# Altium schematic sheet GSMM66.SchDoc
size A2
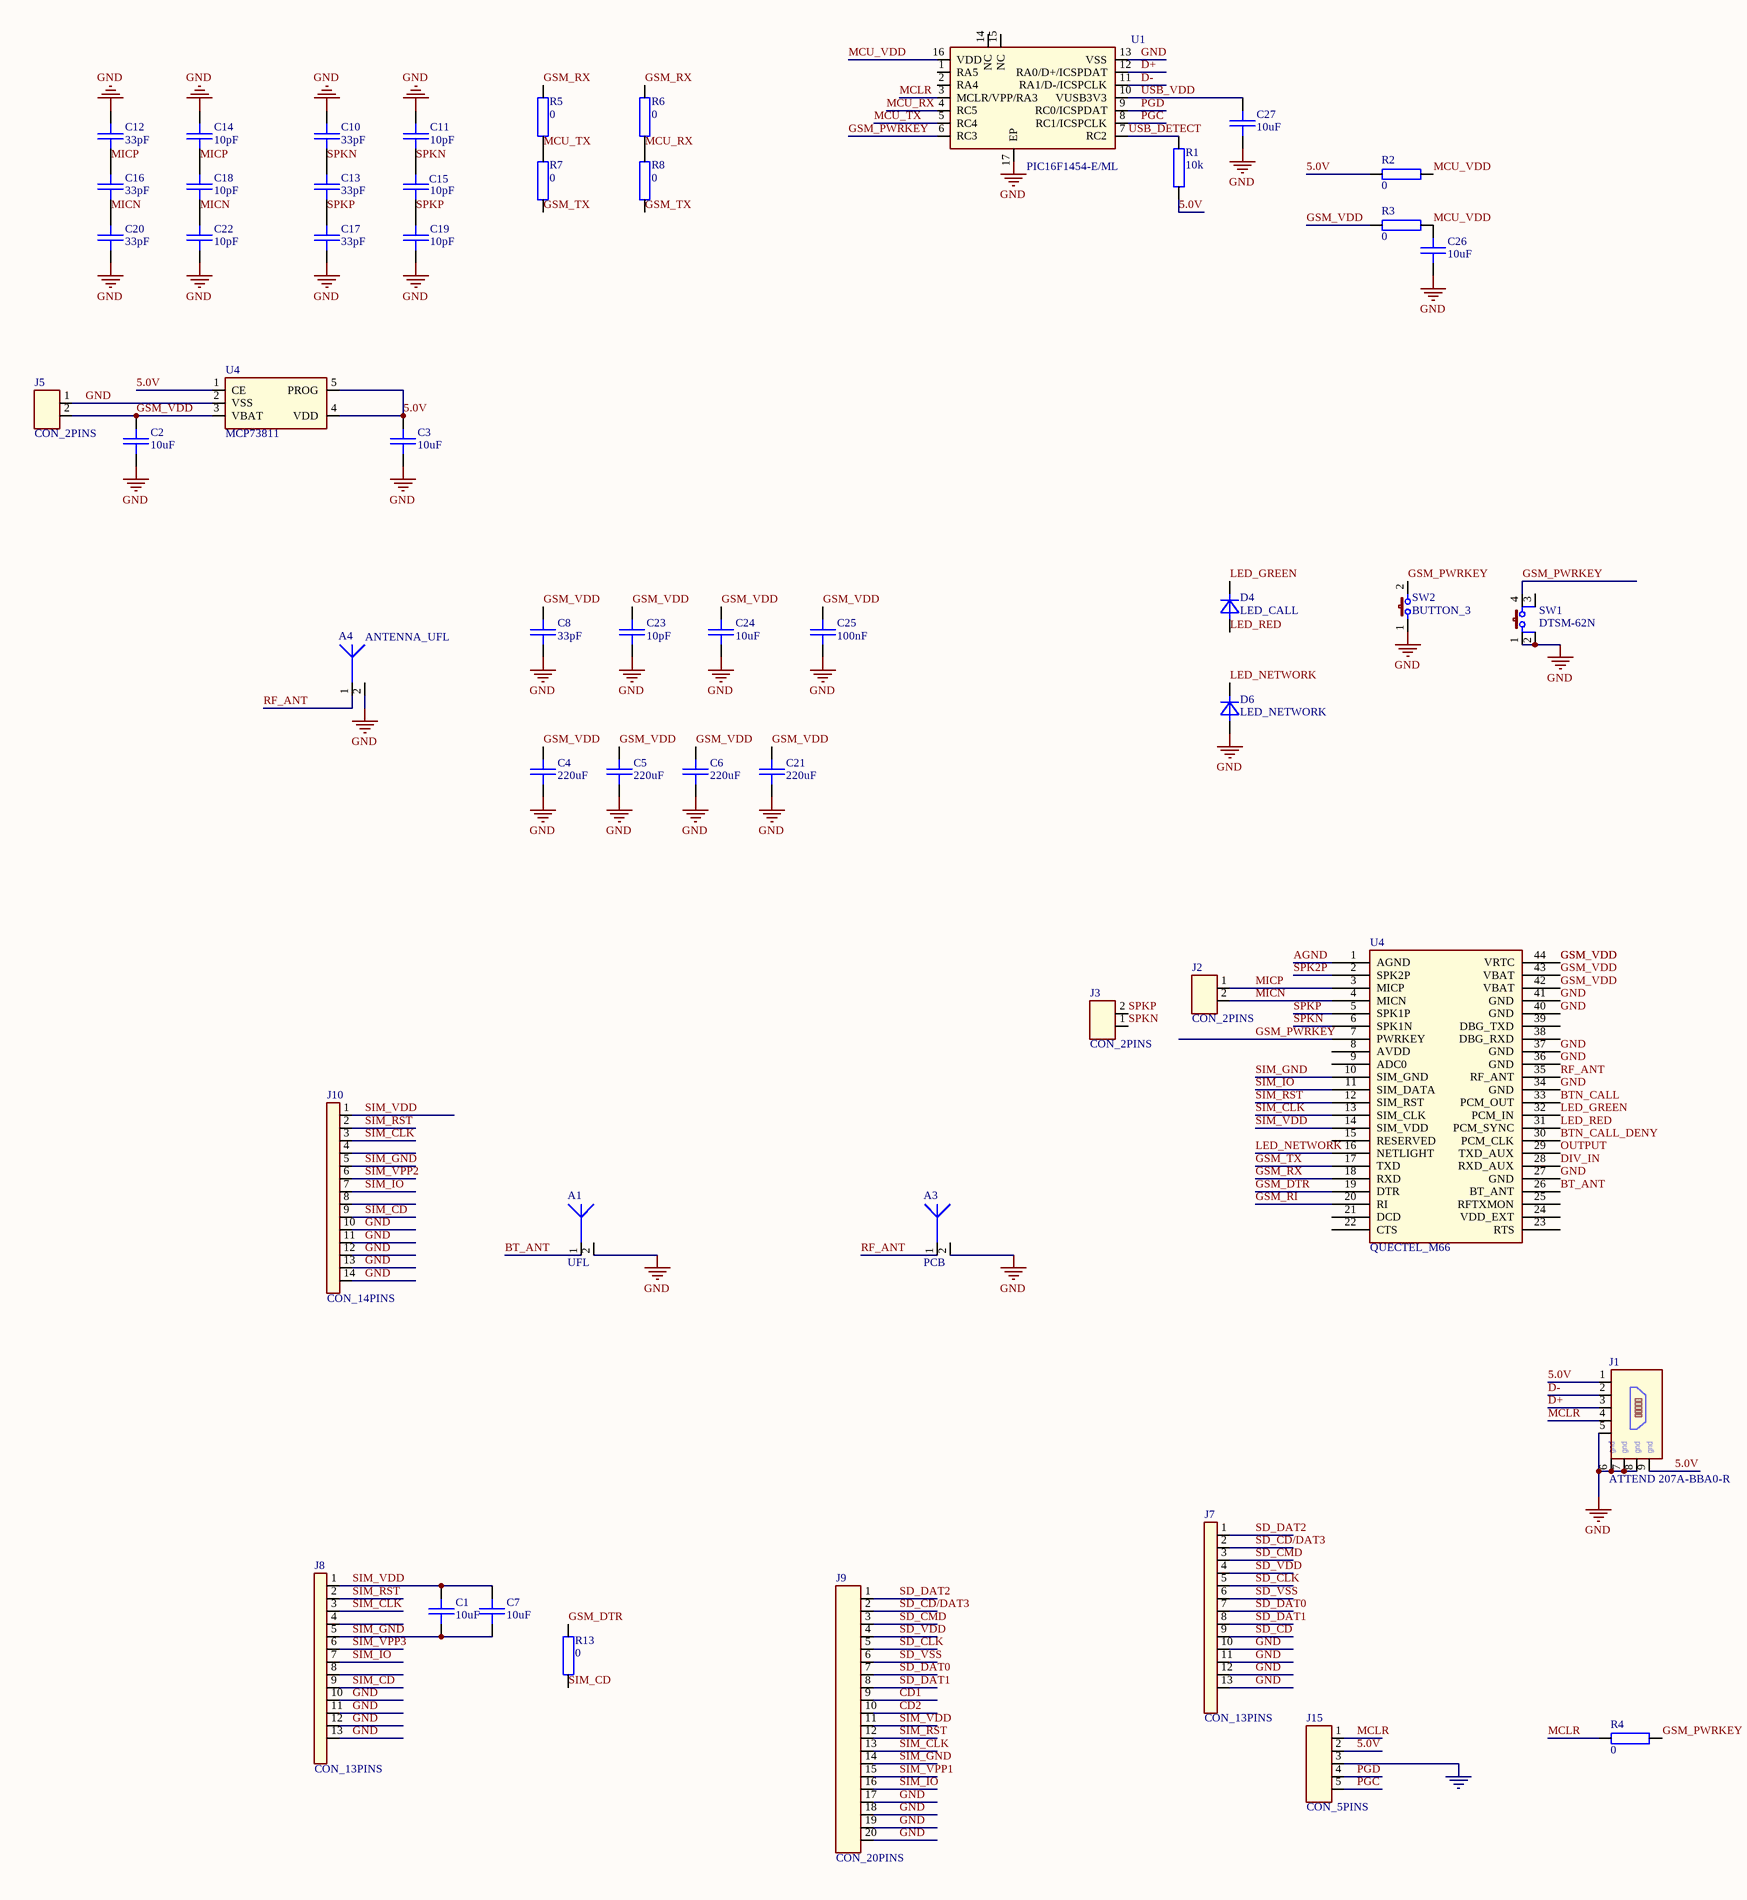
[diagram p0: GSMM66.SchDoc, left]
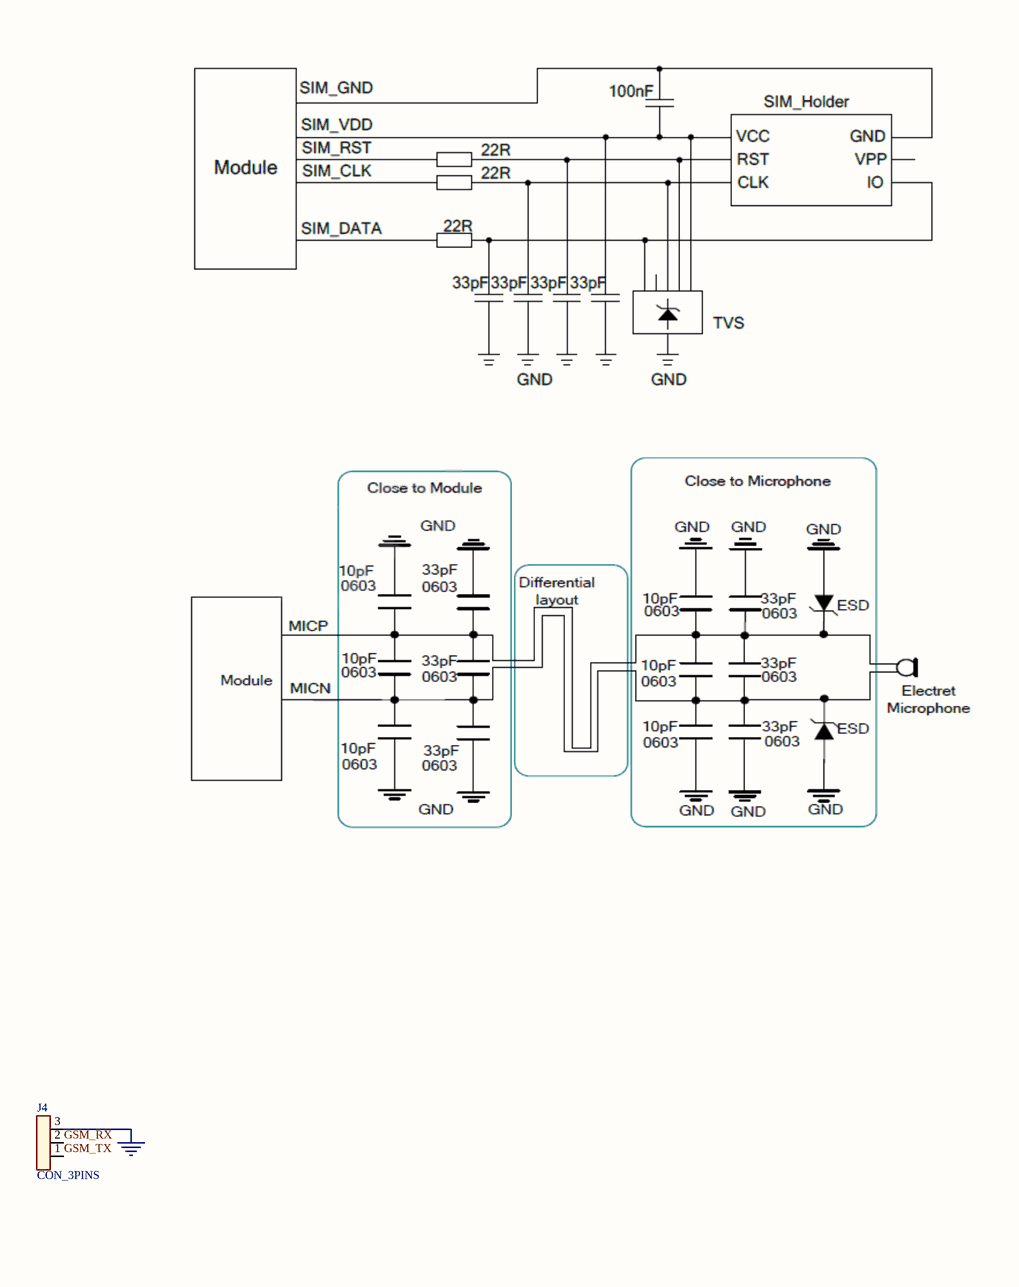
[diagram p1: GSMM66.SchDoc, right]

## Parts
(Parts that share a designator on the sheet are numbered #1, #2 ... from top to bottom, then left to right.)
A1  UFL  [SMD_CON_ANTENNA_UFL]
A3  PCB  [SMD_CON_ANTENNA_GSM_PCB]
A4  ANTENNA_UFL  [SMD_CON_ANTENNA_UFL]
C1  10uF  [SMD_0402_CAPC1005X90N]
C2  10uF  [SMD_0402_CAPC1005X90N]
C3  10uF  [SMD_0402_CAPC1005X90N]
C4  220uF  [SMD_1210_CAPC3225X279N]
C5  220uF  [SMD_1210_CAPC3225X279N]
C6  220uF  [SMD_1210_CAPC3225X279N]
C7  10uF  [SMD_0402_CAPC1005X90N]
C8  33pF  [SMD_0402_CAPC1005X90N]
C10  33pF  [SMD_0402_CAPC1005X90N]
C11  10pF  [SMD_0402_CAPC1005X90N]
C12  33pF  [SMD_0402_CAPC1005X90N]
C13  33pF  [SMD_0402_CAPC1005X90N]
C14  10pF  [SMD_0402_CAPC1005X90N]
C15  10pF  [SMD_0402_CAPC1005X90N]
C16  33pF  [SMD_0402_CAPC1005X90N]
C17  33pF  [SMD_0402_CAPC1005X90N]
C18  10pF  [SMD_0402_CAPC1005X90N]
C19  10pF  [SMD_0402_CAPC1005X90N]
C20  33pF  [SMD_0402_CAPC1005X90N]
C21  220uF  [SMD_1210_CAPC3225X279N]
C22  10pF  [SMD_0402_CAPC1005X90N]
C23  10pF  [SMD_0402_CAPC1005X90N]
C24  10uF  [SMD_0402_CAPC1005X90N]
C25  100nF  [SMD_0402_CAPC1005X90N]
C26  10uF  [SMD_0402_CAPC1005X90N]
C27  10uF  [SMD_0402_CAPC1005X90N]
D4  LED_CALL  [SMD_0805_LED2012X100N]
D6  LED_NETWORK  [SMD_0805_LED2012X100N]
J1  ATTEND 207A-BBA0-R  [SMD_CON_MICRO_USB]
J2  CON_2PINS  [PTH_MIC_6MM_2.7MM_PITCH1.9]
J3  CON_2PINS  [PTH_MIC_6MM_2.7MM_PITCH1.9]
J4  CON_3PINS  [PTH_HDRV03W64P254_1X03]
J5  CON_2PINS  [PTH_HDRV02W64P254_1X02]
J7  CON_13PINS  [NONE]
J8  CON_13PINS  [SMD_CON-ATTEND_MICRO_SIM_115Q-BCA0]
J9  CON_20PINS  [NONE]
J10  CON_14PINS  [SMD_CON-ATTEND_SIM_115A-BDA0-R01]
J15  CON_5PINS  [SIP5 - PGM]
R1  10k  [SMD_0402_RESC1005X37N]
R2  0  [SMD_0402_RESC1005X37N]
R3  0  [SMD_0402_RESC1005X37N]
R4  0  [SMD_0402_RESC1005X37N]
R5  0  [SMD_0402_RESC1005X37N]
R6  0  [SMD_0402_RESC1005X37N]
R7  0  [SMD_0402_RESC1005X37N]
R8  0  [SMD_0402_RESC1005X37N]
R13  0  [SMD_0402_RESC1005X37N]
SW1  DTSM-62N  [SMD_SW_TACT-64K_5]
SW2  BUTTON_3  [SMD_SW_DTSM-3]
U1  PIC16F1454-E/ML  [SMD_QFN50P400X400X90-17N]
U4#1  MCP73811  [SMD_SOT26_SOT95P285X140-5N - DLV]
U4#2  QUECTEL_M66  [SMD_MOD_M66-44N]

## Nets
GND: A1.2 A3.2 A4.2 C2.2 C3.2 C4.2 C5.2 C6.2 C8.2 C10.1 C11.1 C12.1 C14.1 C17.2 C19.2 C20.2 C21.2 C22.2 C23.2 C24.2 C25.2 C26.2 C27.2 D6.2(A) J1.5 J1.6 J1.7 J1.8 J4.3 J5.1 J7.10 J7.11 J7.12 J7.13 J8.10 J8.11 J8.12 J8.13 J9.17 J9.18 J9.19 J9.20 J10.10 J10.11 J10.12 J10.13 J10.14 J15.3 SW1.1 SW1.2 SW2.1 U1.13(VSS) U1.17(EP) U4#1.2(VSS) U4#2.27(GND) U4#2.34(GND) U4#2.36(GND) U4#2.37(GND) U4#2.40(GND) U4#2.41(GND)
5.0V: C3.1 J1.1 J1.9 J15.2 R1.2 R2.1 U4#1.1(CE) U4#1.4(VDD) U4#1.5(PROG)
AGND: U4#2.1(AGND)
BT_ANT: A1.1 U4#2.26(BT_ANT)
BTN_CALL: U4#2.33(PCM_OUT)
BTN_CALL_DENY: U4#2.30(PCM_CLK)
CD1: J9.9
CD2: J9.10
D+: J1.3 U1.12(RA0/D+/ICSPDAT)
D-: J1.2 U1.11(RA1/D-/ICSPCLK)
DIV_IN: U4#2.28(RXD_AUX)
GSM_DTR: R13.1 U4#2.19(DTR)
GSM_PWRKEY: R4.2 SW1.4 SW2.2 U1.6(RC3) U4#2.7(PWRKEY)
GSM_RI: U4#2.20(RI)
GSM_RX: J4.2 R5.2 R6.2 U4#2.18(RXD)
GSM_TX: J4.1 R7.1 R8.1 U4#2.17(TXD)
GSM_VDD: C2.1 C4.1 C5.1 C6.1 C8.1 C21.1 C23.1 C24.1 C25.1 J5.2 R3.1 U4#1.3(VBAT) U4#2.42(VBAT) U4#2.43(VBAT) U4#2.44(VRTC)
LED_GREEN: D4.1(C) U4#2.32(PCM_IN)
LED_NETWORK: D6.1(C) U4#2.16(NETLIGHT)
LED_RED: D4.2(A) U4#2.31(PCM_SYNC)
MCLR: J1.4 J15.1 R4.1 U1.3(MCLR/VPP/RA3)
MCU_RX: R6.1 R8.2 U1.4(RC5)
MCU_TX: R5.1 R7.2 U1.5(RC4)
MCU_VDD: C26.1 R2.2 R3.2 U1.16(VDD)
MICN: C16.2 C18.2 C20.1 C22.1 J2.2 U4#2.4(MICN)
MICP: C12.2 C14.2 C16.1 C18.1 J2.1 U4#2.3(MICP)
OUTPUT: U4#2.29(TXD_AUX)
PGC: J15.5 U1.8(RC1/ICSPCLK)
PGD: J15.4 U1.9(RC0/ICSPDAT)
RF_ANT: A3.1 A4.1 U4#2.35(RF_ANT)
SD_CD: J7.9
SD_CD/DAT3: J7.2 J9.2
SD_CLK: J7.5 J9.5
SD_CMD: J7.3 J9.3
SD_DAT0: J7.7 J9.7
SD_DAT1: J7.8 J9.8
SD_DAT2: J7.1 J9.1
SD_VDD: J7.4 J9.4
SD_VSS: J7.6 J9.6
SIM_CD: J8.9 J10.9 R13.2
SIM_CLK: J8.3 J9.13 J10.3 U4#2.13(SIM_CLK)
SIM_GND: C1.2 C7.2 J8.5 J9.14 J10.5 U4#2.10(SIM_GND)
SIM_IO: J8.7 J9.16 J10.7 U4#2.11(SIM_DATA)
SIM_RST: J8.2 J9.12 J10.2 U4#2.12(SIM_RST)
SIM_VDD: C1.1 C7.1 J8.1 J9.11 J10.1 U4#2.14(SIM_VDD)
SIM_VPP1: J9.15
SIM_VPP2: J10.6
SIM_VPP3: J8.6
SPK2P: U4#2.2(SPK2P)
SPKN: C10.2 C11.2 C13.1 C15.1 J3.1 U4#2.6(SPK1N)
SPKP: C13.2 C15.2 C17.1 C19.1 J3.2 U4#2.5(SPK1P)
USB_DETECT: R1.1 U1.7(RC2)
USB_VDD: C27.1 U1.10(VUSB3V3)

Not connected (* = marked no-connect by the designer): J8 4 8; J10 4 8; SW1 3; U1 1(RA5) 2(RA4) 14(NC) 15(NC); U4#2 8(AVDD) 9(ADC0) 15(RESERVED) 21(DCD) 22(CTS) 23(RTS) 24(VDD_EXT) 25(RFTXMON) 38(DBG_RXD) 39(DBG_TXD)

## Notes on the sheet
- (in symbol CON_USB_MINI) gnd

## Library data of the parts
A1 A3 A4 = ANTENNA_2: NOTE: <NOTE>
C1-C8 C10-C27 = C: NOTE: <NOTE>
D4 D6 = D: NOTE: <NOTE>
J1 = CON_USB_MINI: NOTE: <NOTE>
J2 J3 J5 = CON_2PINS: NOTE: <NOTE>
J15 = CON_5PINS: NOTE: <NOTE>
R1-R8 R13 = R: NOTE: <NOTE>; R_BDS: R
SW1 = BUTTON_1
U1 = IC_PIC16F1454-QFN
U4#1 = IC_MCP73812: MCP73812; DB_PART_NUMBER: PSU000000127; DB_PART_TYPE: Linear Voltage Regulator; DB_MANUFACTURER_PART: ROHM        BD33KA5WF-E2; DB_T_RANGE: -40 to 105; DB_VOLTAGE: 3.3V; DB_CURRENT: 500mA; DB_PACKAGE: SOIC-8; DB_DESCRIPTION: IC BD33KA5WF-E2 SOIC-8; DB_PCB_DEVICE: SMD_SOIC127P620X160-8N; DB_CERTIFIED: ISHIDDEN=T; DB_APPROVED_BY: VSN; DB_APPROVED_ON: 07.5.2014 г. 13:18:28; DB_STATUS: NEW; DB_DATASHEET: http://john.epiqdesign.com/projects/CIS_Datasheets/IC_bdxxka5wf-e-209388.pdf?rev=1408&sc=0
U4#2 = MOD_QUECTEL_M66